# EAGLE design scheme (EAGLE 9.3.1)

## Sheet 1 of 6: Power Supply
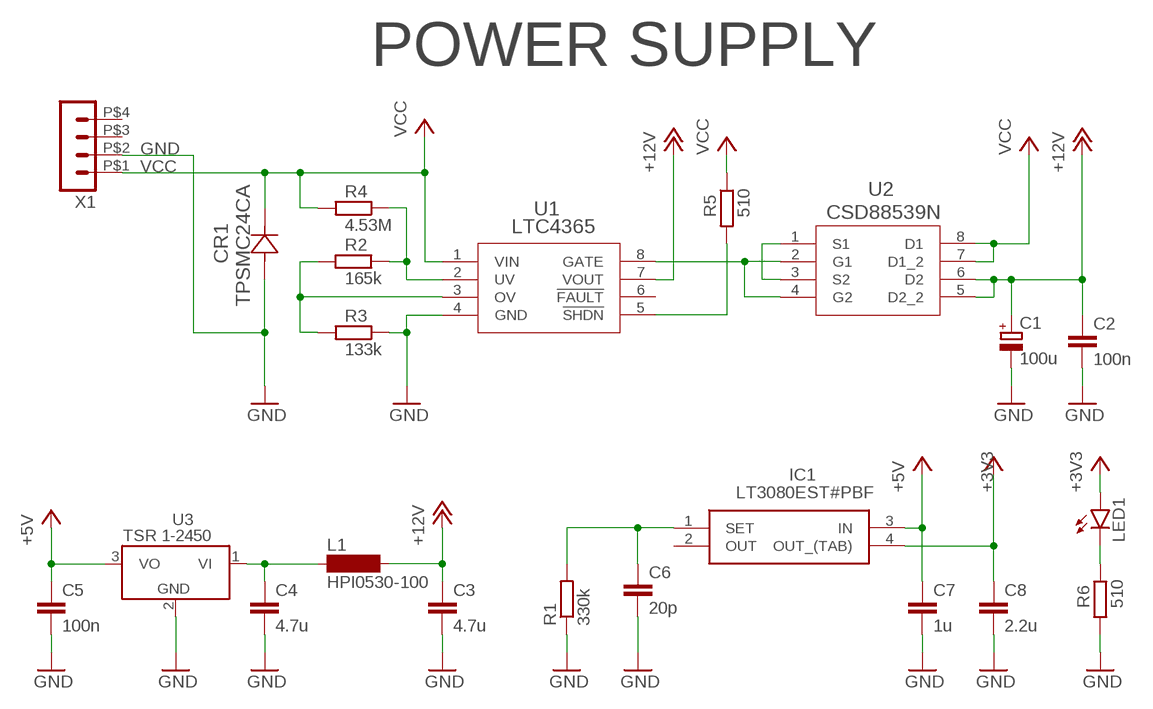
[diagram p0: schematic, sheet 1]

### Parts
C1  100u  CPOL-EUUD-6,3X7,7  [UD-6,3X7,7_NICHICON]
C2  100n  C-EUC0603K  [C0603K]
C3  4.7u  C-EUC0805  [C0805]
C4  4.7u  C-EUC0805  [C0805]
C5  100n  C-EUC0603K  [C0603K]
C6  20p  C-EUC0603K  [C0603K]
C7  1u  C-EUC0603  [C0603]
C8  2.2u  C-EUC0603  [C0603]
CR1  TPSMC24CA  TPSMC24CATPSMCSERIES-M  [TPSMCSERIES-M]
IC1  LT3080EST#PBF  [SOT230P700X180-4N]
L1  HPI0530-100  MS85  [MS85]
LED1  LEDCHIP-LED0805  [CHIP-LED0805]
R1  330k  R-EU_R0805  [R0805]
R2  165k  R-EU_R0603  [R0603]
R3  133k  R-EU_R0603  [R0603]
R4  4.53M  R-EU_R0603  [R0603]
R5  510  R-EU_R0603  [R0603]
R6  510  R-EU_R0603  [R0603]
U1  LTC4365  LTC4365CTS8TRMPBFTSOT-23_TS8-M  [TSOT-23_TS8-M]
U2  CSD88539N  CSD88539NDTD8-M  [D8-M]
U3  TSR 1-2450  TSR_1-2450  [TSR-1]
X1  HEADER_POS4_43045-0401  [43045-0400]

### Nets
+3V3: C8.1 IC1.4(OUT_(TAB)) LED1.A ; also sheet 2,3,4
+5V: C5.1 C7.1 IC1.3(IN) U3.3(VO) ; also sheet 3,4
+12V: C1.+ C2.1 C3.1 L1.2 U1.7(VOUT) U2.5(D2_2) U2.6(D2) ; also sheet 6
GND: C1.- C2.2 C3.2 C4.2 C5.2 C6.2 C7.2 C8.2 CR1.2 R1.1 R3.1 R6.2 U1.4(GND) U3.2(GND) X1.P$2 ; also sheet 2,3,4,5,6
LTC_G: U1.8(GATE) U2.2(G1) U2.4(G2)
N$1: R2.1 R3.2 U1.3(OV)
N$3: R5.2 U1.5(!SHDN)
N$4: R2.2 R4.1 U1.2(UV)
N$6: U2.1(S1) U2.3(S2)
N$7: C6.1 IC1.1(SET) R1.2
N$13: LED1.C R6.1
VCC: CR1.1 R4.2 R5.1 U1.1(VIN) U2.7(D1_2) U2.8(D1) X1.P$1
VI: C4.1 L1.1 U3.1(VI)
Unconnected: IC1.2(OUT) U1.6(!FAULT) X1.P$3 X1.P$4

### Notes on the sheet
- POWER SUPPLY

## Sheet 2 of 6: MCU
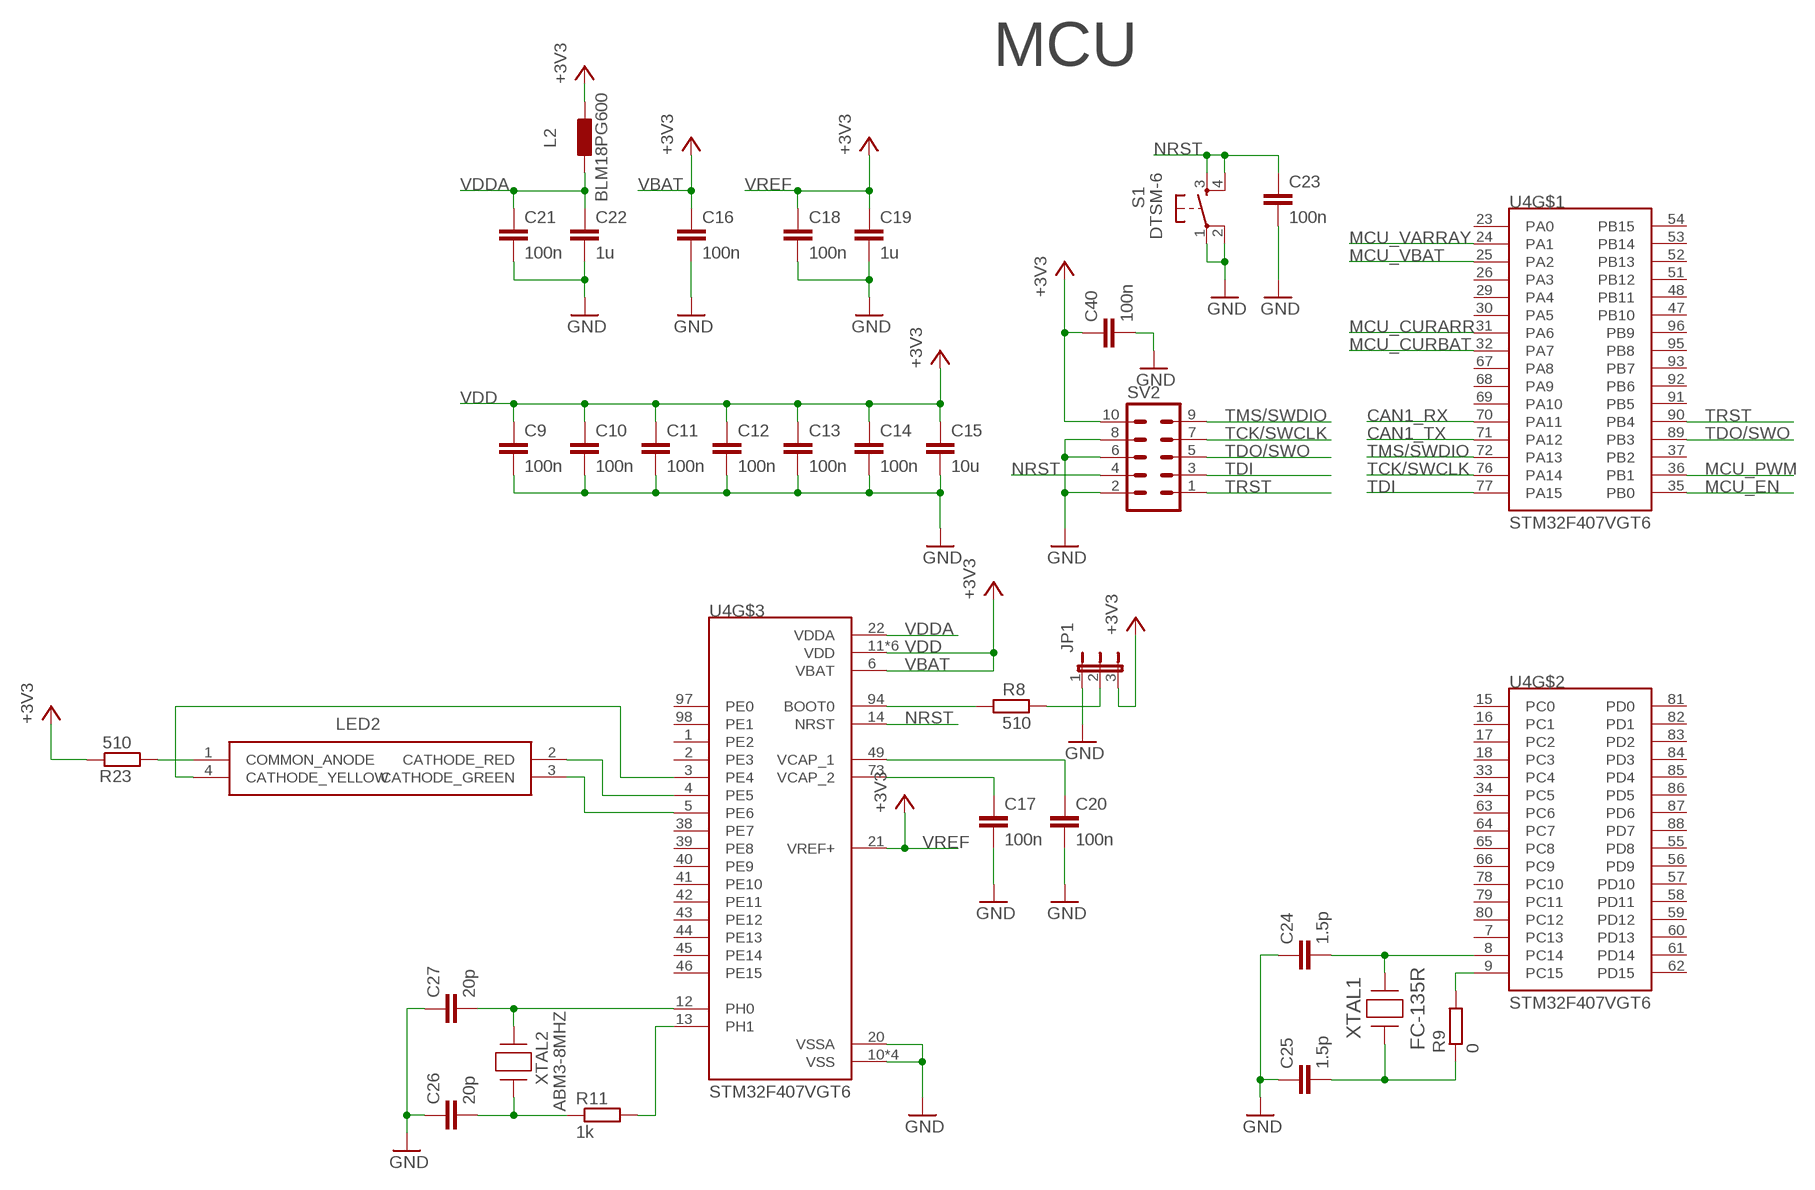
[diagram p1: schematic, sheet 2]

### Parts
C9  100n  C-EUC0603K  [C0603K]
C10  100n  C-EUC0603K  [C0603K]
C11  100n  C-EUC0603K  [C0603K]
C12  100n  C-EUC0603K  [C0603K]
C13  100n  C-EUC0603K  [C0603K]
C14  100n  C-EUC0603K  [C0603K]
C15  10u  C-EUC0603K  [C0603K]
C16  100n  C-EUC0603K  [C0603K]
C17  100n  C-EUC0603K  [C0603K]
C18  100n  C-EUC0603K  [C0603K]
C19  1u  C-EUC0603  [C0603]
C20  100n  C-EUC0603K  [C0603K]
C21  100n  C-EUC0603K  [C0603K]
C22  1u  C-EUC0603  [C0603]
C23  100n  C-EUC0603K  [C0603K]
C24  1.5p  C-EUC0603K  [C0603K]
C25  1.5p  C-EUC0603K  [C0603K]
C26  20p  C-EUC0603K  [C0603K]
C27  20p  C-EUC0603K  [C0603K]
C40  100n  C-EUC0805K  [C0805K]
JP1  JP2E  [JP2]
L2  BLM18PG600  L_EU_L0603  [L1608]
LED2  APTF1616SURKCGKSYKC  [KPTF1616RGBC11]
R8  510  R-EU_R0603  [R0603]
R9  0  R-EU_R0603  [R0603]
R11  1k  R-EU_R0603  [R0603]
R23  510  R-EU_R0603  [R0603]
S1  DTSM-6  [DTSM-6]
SV2  ML10  [ML10]
U4  STM32F407VGT6  [QFP50P1600X1600X160-100N]
XTAL1  FC-135R  FC-135R_32.7680KA-A3  [XTAL_KA-A3]
XTAL2  ABM3-8MHZ  ABM3-8.000MHZ-D2Y-T  [ABM38000MHZD2YT]

### Nets
+3V3: C9.1 C10.1 C11.1 C12.1 C13.1 C14.1 C15.1 C16.1 C18.1 C19.1 C40.1 JP1.3 L2.2 R23.1 SV2.10 U4.6(VBAT) U4.11(VDD) U4.19(VDD) U4.21(VREF+) U4.28(VDD) U4.50(VDD) U4.75(VDD) U4.100(VDD) ; also sheet 1,3,4
CAN1_RX: U4.70(PA11) ; also sheet 3
CAN1_TX: U4.71(PA12) ; also sheet 3
GND: C9.2 C10.2 C11.2 C12.2 C13.2 C14.2 C15.2 C16.2 C17.2 C18.2 C19.2 C20.2 C21.2 C22.2 C23.2 C24.1 C25.1 C26.1 C27.1 C40.2 JP1.1 S1.1 S1.2 SV2.2 SV2.6 SV2.8 U4.10(VSS) U4.20(VSSA) U4.27(VSS) U4.74(VSS) U4.99(VSS) ; also sheet 1,3,4,5,6
MCU_CURARR: U4.31(PA6) ; also sheet 5
MCU_CURBAT: U4.32(PA7) ; also sheet 5
MCU_EN: U4.35(PB0) ; also sheet 4
MCU_PWM: U4.36(PB1) ; also sheet 4
MCU_VARRAY: U4.24(PA1) ; also sheet 5
MCU_VBAT: U4.25(PA2) ; also sheet 5
N$2: C26.2 R11.1 XTAL2.1
N$5: C17.1 U4.73(VCAP_2)
N$8: C20.1 U4.49(VCAP_1)
N$9: R8.1 U4.94(BOOT0)
N$10: JP1.2 R8.2
N$11: C25.2 R9.1 XTAL1.1
N$12: R9.2 U4.9(PC15)
N$14: C24.2 U4.8(PC14) XTAL1.2
N$15: C27.2 U4.12(PH0) XTAL2.2
N$17: R11.2 U4.13(PH1)
N$24: LED2.1(COMMON_ANODE) R23.2
N$28: LED2.3(CATHODE_GREEN) U4.5(PE6)
N$29: LED2.2(CATHODE_RED) U4.4(PE5)
N$30: LED2.4(CATHODE_YELLOW) U4.3(PE4)
NRST: C23.1 S1.3 S1.4 SV2.4 U4.14(NRST)
TCK/SWCLK: SV2.7 U4.76(PA14)
TDI: SV2.3 U4.77(PA15)
TDO/SWO: SV2.5 U4.89(PB3)
TMS/SWDIO: SV2.9 U4.72(PA13)
TRST: SV2.1 U4.90(PB4)
VDDA: C21.1 C22.1 L2.1 U4.22(VDDA)
Unconnected: U4.1(PE2) U4.2(PE3) U4.7(PC13) U4.15(PC0) U4.16(PC1) U4.17(PC2) U4.18(PC3) U4.23(PA0) U4.26(PA3) U4.29(PA4) U4.30(PA5) U4.33(PC4) U4.34(PC5) U4.37(PB2) U4.38(PE7) U4.39(PE8) U4.40(PE9) U4.41(PE10) U4.42(PE11) U4.43(PE12) U4.44(PE13) U4.45(PE14) U4.46(PE15) U4.47(PB10) U4.48(PB11) U4.51(PB12) U4.52(PB13) U4.53(PB14) U4.54(PB15) U4.55(PD8) U4.56(PD9) U4.57(PD10) U4.58(PD11) U4.59(PD12) U4.60(PD13) U4.61(PD14) U4.62(PD15) U4.63(PC6) U4.64(PC7) U4.65(PC8) U4.66(PC9) U4.67(PA8) U4.68(PA9) U4.69(PA10) U4.78(PC10) U4.79(PC11) U4.80(PC12) U4.81(PD0) U4.82(PD1) U4.83(PD2) U4.84(PD3) U4.85(PD4) U4.86(PD5) U4.87(PD6) U4.88(PD7) U4.91(PB5) U4.92(PB6) U4.93(PB7) U4.95(PB8) U4.96(PB9) U4.97(PE0) U4.98(PE1)

### Notes on the sheet
- MCU
- VBAT | VREF
- VDD
- VDD
- VBAT
- VREF

## Sheet 3 of 6: CAN Bus
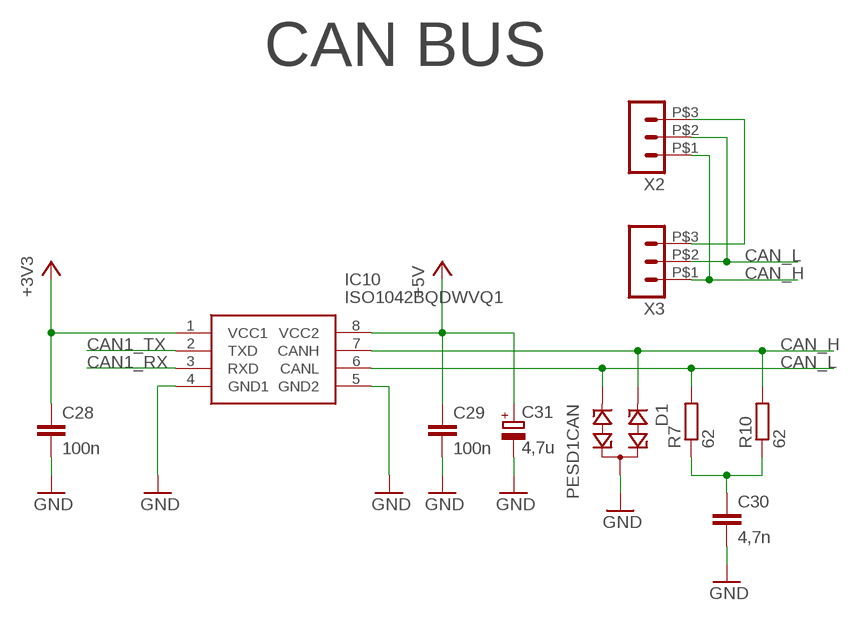
[diagram p2: schematic, sheet 3]

### Parts
C28  100n  C-EUC0603K  [C0603K]
C29  100n  C-EUC0603K  [C0603K]
C30  4,7n  C-EUC0603K  [C0603K]
C31  4,7u  CPOL-EUUD-4X5,8  [UD-4X5,8_NICHICON]
D1  PESD1CAN  [SOT23]
IC10  ISO1042BQDWVQ1  [SOIC127P1150X280-8N]
R7  62  R-EU_R0603  [R0603]
R10  62  R-EU_R0603  [R0603]
X2  HEADER_POS3_43650-0300  [43650-0300]
X3  HEADER_POS3_43650-0300  [43650-0300]

### Nets
+3V3: C28.1 IC10.1(VCC1) ; also sheet 1,2,4
+5V: C29.1 C31.+ IC10.8(VCC2) ; also sheet 1,4
CAN1_RX: IC10.3(RXD) ; also sheet 2
CAN1_TX: IC10.2(TXD) ; also sheet 2
CAN_H: D1.1 IC10.7(CANH) R10.2 X2.P$1 X3.P$1
CAN_L: D1.2 IC10.6(CANL) R7.2 X2.P$2 X3.P$2
GND: C28.2 C29.2 C30.2 C31.- D1.3 IC10.4(GND1) ; also sheet 1,2,4,5,6
N$16: C30.1 R7.1 R10.1
N$20: X2.P$3 X3.P$3
N$22: IC10.5(GND2) ; supply symbol labelled GND

### Notes on the sheet
- CAN BUS

## Sheet 4 of 6: GPIO Isolator
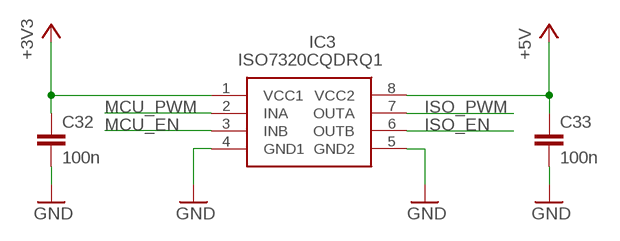
[diagram p3: schematic, sheet 4]

### Parts
C32  100n  C-EUC0603K  [C0603K]
C33  100n  C-EUC0603K  [C0603K]
IC3  ISO7320CQDRQ1  [SOIC127P600X175-8N]

### Nets
+3V3: C32.1 IC3.1(VCC1) ; also sheet 1,2,3
+5V: C33.1 IC3.8(VCC2) ; also sheet 1,3
GND: C32.2 C33.2 IC3.4(GND1) IC3.5(GND2) ; also sheet 1,2,3,5,6
ISO_EN: IC3.6(OUTB) ; also sheet 6
ISO_PWM: IC3.7(OUTA) ; also sheet 6
MCU_EN: IC3.3(INB) ; also sheet 2
MCU_PWM: IC3.2(INA) ; also sheet 2

## Sheet 5 of 6: MPPT Power Stage
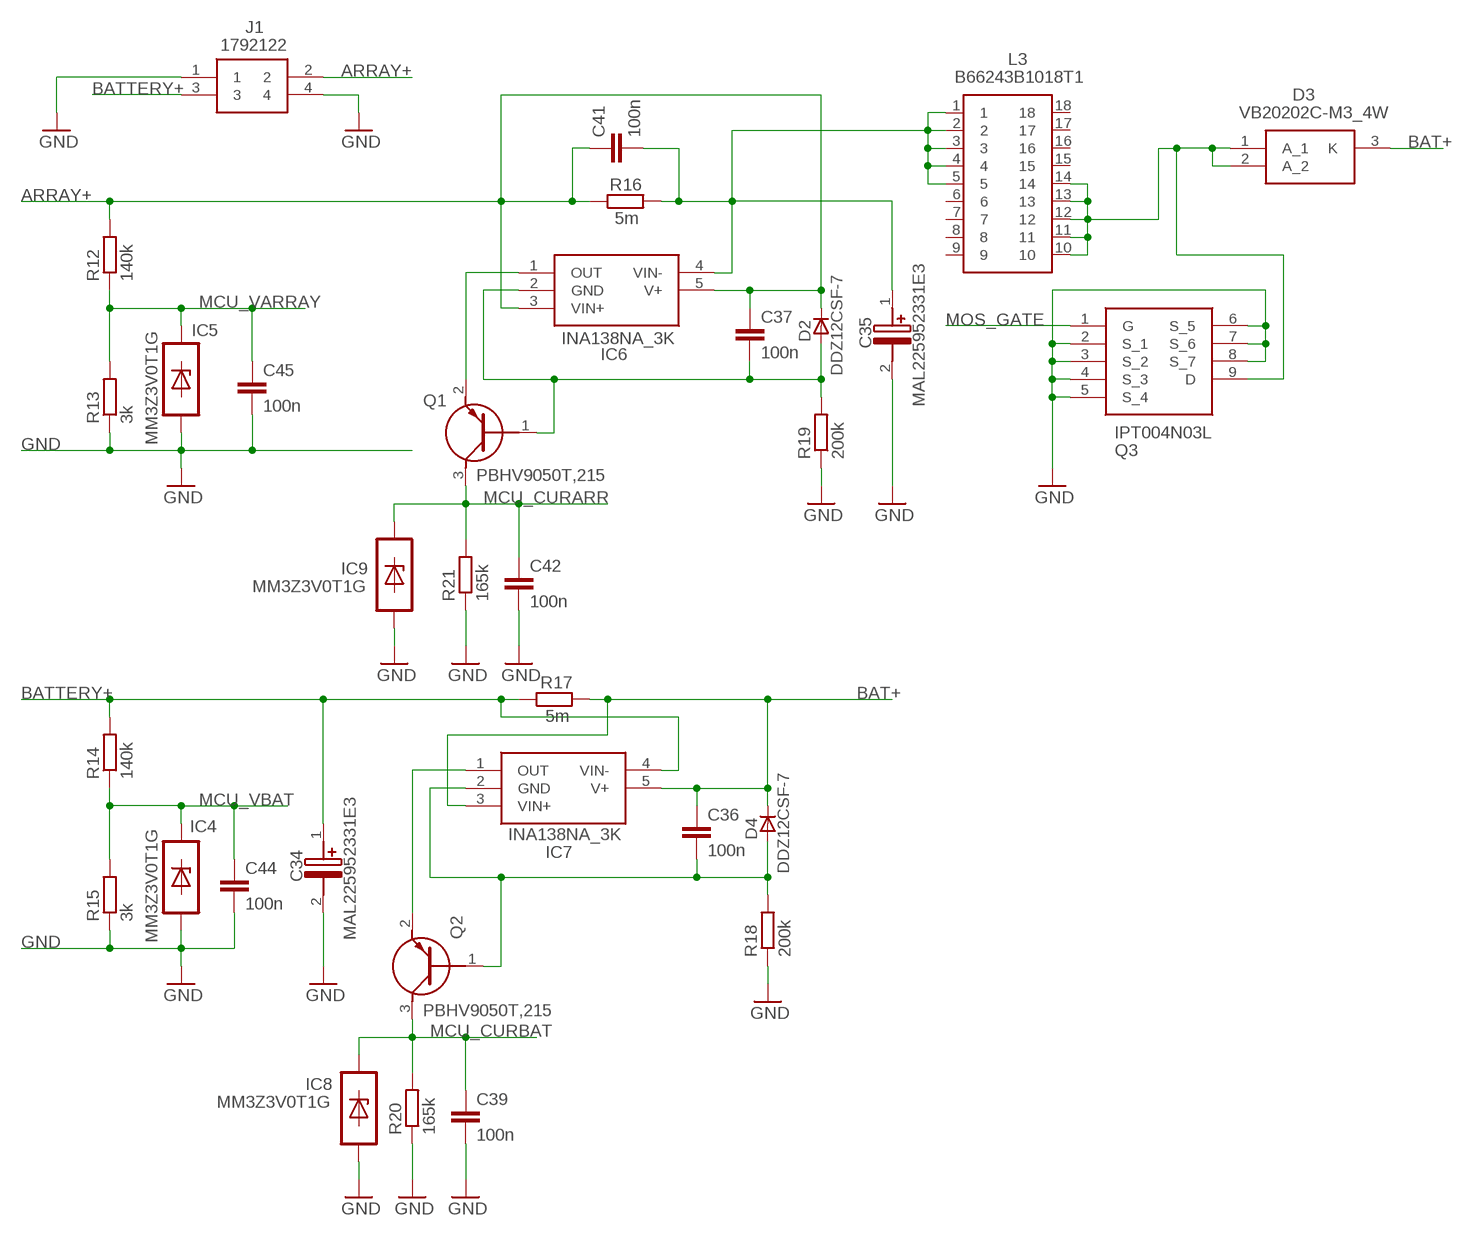
[diagram p4: schematic, sheet 5]

### Parts
C34  MAL225952331E3  [CAPPRD1000W200D2200H3000]
C35  MAL225952331E3  [CAPPRD1000W200D2200H3000]
C36  100n  C-EUC0603K  [C0603K]
C37  100n  C-EUC0603K  [C0603K]
C39  100n  C-EUC0603K  [C0603K]
C41  100n  C-EUC0603K  [C0603K]
C42  100n  C-EUC0603K  [C0603K]
C44  100n  C-EUC0805  [C0805]
C45  100n  C-EUC0805  [C0805]
D2  DDZ12CSF-7  1N4448WS  [SOD323F]
D3  VB20202C-M3_4W  [VB20202CM34W]
D4  DDZ12CSF-7  1N4448WS  [SOD323F]
IC4  MM3Z3V0T1G  SP4020-01FTG  [SOD323]
IC5  MM3Z3V0T1G  SP4020-01FTG  [SOD323]
IC6  INA138NA_3K  [SOT95P280X145-5N]
IC7  INA138NA_3K  [SOT95P280X145-5N]
IC8  MM3Z3V0T1G  SP4020-01FTG  [SOD323]
IC9  MM3Z3V0T1G  SP4020-01FTG  [SOD323]
J1  1792122  [1792122]
L3  B66243B1018T1  [DIPS2750W100P500L4600H4140Q18N]
Q1  PBHV9050T,215  [SOT95P230X110-3N]
Q2  PBHV9050T,215  [SOT95P230X110-3N]
Q3  IPT004N03L  [PG-HSOF-8-1]
R12  140k  R-EU_R0603  [R0603]
R13  3k  R-EU_R0603  [R0603]
R14  140k  R-EU_R0603  [R0603]
R15  3k  R-EU_R0603  [R0603]
R16  5m  R-EU_R2512  [R2512]
R17  5m  R-EU_R2512  [R2512]
R18  200k  R-EU_R0805  [R0805]
R19  200k  R-EU_R0805  [R0805]
R20  165k  R-EU_R0805  [R0805]
R21  165k  R-EU_R0805  [R0805]

### Nets
ARRAY+: C37.1 C41.1 D2.C IC6.3(VIN+) IC6.5(V+) J1.2 R12.2 R16.1
BAT+: C36.1 D3.3(K) D4.C IC7.3(VIN+) IC7.5(V+) R17.2
BATTERY+: C34.1(+) IC7.4(VIN-) J1.3 R14.2 R17.1
GND: C34.2(-) C35.2(-) C39.2 C42.2 C44.2 C45.2 IC4.2 IC5.2 IC8.2 IC9.2 J1.1 J1.4 Q3.2(S_1) Q3.3(S_2) Q3.4(S_3) Q3.5(S_4) Q3.6(S_5) Q3.7(S_6) Q3.8(S_7) R13.1 R15.1 R18.1 R19.1 R20.1 R21.1 ; also sheet 1,2,3,4,6
MCU_CURARR: C42.1 IC9.1 Q1.3(C) R21.2 ; also sheet 2
MCU_CURBAT: C39.1 IC8.1 Q2.3(C) R20.2 ; also sheet 2
MCU_VARRAY: C45.1 IC5.1 R12.1 R13.2 ; also sheet 2
MCU_VBAT: C44.1 IC4.1 R14.1 R15.2 ; also sheet 2
MOS_GATE: Q3.1(G) ; also sheet 6
N$18: C35.1(+) C41.2 IC6.4(VIN-) L3.1 L3.2 L3.3 L3.4 L3.5 R16.2
N$19: D3.1(A_1) D3.2(A_2) L3.10 L3.11 L3.12 L3.13 L3.14 Q3.9(D)
N$21: IC7.1(OUT) Q2.2(E)
N$23: IC6.1(OUT) Q1.2(E)
N$25: C36.2 D4.A IC7.2(GND) Q2.1(B) R18.2
N$26: C37.2 D2.A IC6.2(GND) Q1.1(B) R19.2
Unconnected: L3.6 L3.7 L3.8 L3.9 L3.15 L3.16 L3.17 L3.18

## Sheet 6 of 6: MOSFET DRIVER
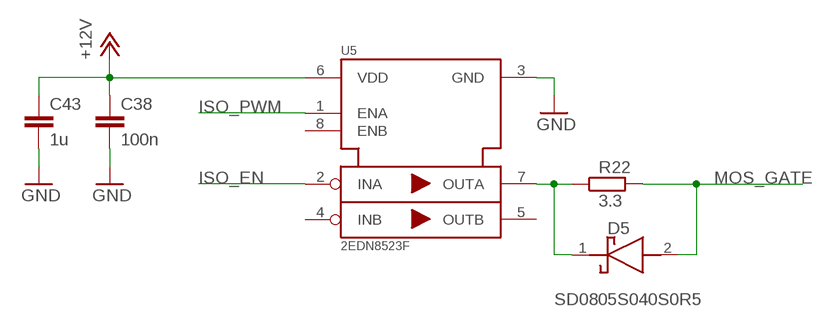
[diagram p5: schematic, sheet 6]

### Parts
C38  100n  C-EUC0603K  [C0603K]
C43  1u  C-EUC0603K  [C0603K]
D5  SD0805S040S0R5  [SD0805]
R22  3.3  R-EU_R0805  [R0805]
U5  2EDN8523F  [SOIC127P602X173-8N-V]

### Nets
+12V: C38.1 C43.1 U5.6(VDD) ; also sheet 1
GND: C38.2 C43.2 U5.3(GND) ; also sheet 1,2,3,4,5
ISO_EN: U5.2(INA) ; also sheet 4
ISO_PWM: U5.1(ENA) ; also sheet 4
MOS_GATE: D5.2(A) R22.2 ; also sheet 5
N$27: D5.1(K) R22.1 U5.7(OUTA)
Unconnected: U5.4(INB) U5.5(OUTB) U5.8(ENB)

## Library data of the parts
C1 C31 = rcl:CPOL-EU: POLARIZED CAPACITOR, European symbol; SPICEPREFIX: C
C2-C30 C32 C33 C36-C45 = rcl:C-EU: CAPACITOR, European symbol; SPICEPREFIX: C
C34 C35 = C_330uF_MAL225952331E3:MAL225952331E3: Aluminum Electrolytic Capacitors - Snap In 330uF 200V 20% 105C 3000H 22x30mm Source: Datasheet <http://www.mouser.com/datasheet/2/427/259phmsi-1289014.pdf>; DESCRIPTION: Aluminum Electrolytic Capacitors - Snap In 330uF 200V 20% 105C 3000H 22x30mm; HEIGHT: 30mm; MANUFACTURER_NAME: Vishay; MANUFACTURER_PART_NUMBER: MAL225952331E3
CR1 = TVS-TPSMC23CA:TPSMC24CA; BUILT_BY: EMA_UL_Team; MANUFACTURER_PART_NUMBER: TPSMC24CA; VENDOR: Littelfuse Inc
D1 = diode:PESD1CAN: CAN bus ESD protection diode Source: http://www.nxp.com/documents/data_sheet/PESD1CAN.pdf
D2 D4 = _hhn_diodes_smd:1N4448WS: 1N4448 General Purpose Rectifie SMD-Version of 1N4448 Case: SOD 323 F Author: Dipl.-Ing. FH Rainer Bayer HHN Hochschule Heilbronn, rainer.bayer@hs-heilbronn.de Ingenieurbüro ing-rb, mail@ing-rb.de
D3 = SamacSys_Parts:VB20202C-M3_4W: Schottky Diodes & Rectifiers 20A 200V Trench Stky Rectifier Source: Datasheet <https://www.vishay.com/docs/87797/v20202c.pdf>; ARROW_PART_NUMBER: VB20202C-M3/4W; DESCRIPTION: Schottky Diodes & Rectifiers 20A 200V Trench Stky Rectifier; HEIGHT: 4.83mm; MANUFACTURER_NAME: Vishay; MANUFACTURER_PART_NUMBER: VB20202C-M3/4W; MOUSER_PART_NUMBER: 78-VB20202C-M3/4W; MOUSER_PRICE-STOCK: https://www.mouser.com/Search/Refine.aspx?Keyword=78-VB20202C-M3%2F4W
D5 = SamacSys_Parts:SD0805S040S0R5: AVX - SD0805S040S0R5 - DIODE, SCHOTTKY, 0.5A, 40V, SOD-323 Source: Datasheet <http://catalogs.avx.com/SchottkyDiodes.pdf>; ARROW_PART_NUMBER: SD0805S040S0R5; ARROW_PRICE-STOCK: https://www.arrow.com/en/products/sd0805s040s0r5/avx; DESCRIPTION: AVX - SD0805S040S0R5 - DIODE, SCHOTTKY, 0.5A, 40V, SOD-323; HEIGHT: mm; MANUFACTURER_NAME: AVX; MANUFACTURER_PART_NUMBER: SD0805S040S0R5; MOUSER_PART_NUMBER: 581-SD0805S040S0R5; MOUSER_PRICE-STOCK: https://www.mouser.co.uk/ProductDetail/AVX/SD0805S040S0R5?qs=jCA%252BPfw4LHZwphObYhjVUA%3D%3D
IC1 = SamacSys_Parts:LT3080EST#PBF: Adjust single Resistor 1.1A LDO LT3080 LT3080EST#PBF, Low Dropout Voltage Regulator, Adjustable 1.1A, 0 30 V, 4-Pin SOT-223 Source: Datasheet <https://componentsearchengine.com/Datasheets/1/LT3080EST#PBF.pdf>; DESCRIPTION: Adjust single Resistor 1.1A LDO LT3080 LT3080EST#PBF, Low Dropout Voltage Regulator, Adjustable 1.1A, 0 30 V, 4-Pin SOT-223; HEIGHT: 1.8mm; MANUFACTURER_NAME: Linear Technology; MANUFACTURER_PART_NUMBER: LT3080EST#PBF; MOUSER_PART_NUMBER: 584-LT3080EST#PBF; MOUSER_PRICE-STOCK: https://www.mouser.com/Search/Refine.aspx?Keyword=584-LT3080EST%23PBF
IC3 = SamacSys_Parts:ISO7320CQDRQ1: TEXAS INSTRUMENTS - ISO7320CQDRQ1 - DIGITAL ISOLATOR, SOIC-8 Source: Datasheet <http://www.ti.com/general/docs/lit/getliterature.tsp?genericPartNumber=ISO7320-Q1&&fileType=pdf>; DESCRIPTION: TEXAS INSTRUMENTS - ISO7320CQDRQ1 - DIGITAL ISOLATOR, SOIC-8; HEIGHT: 1.75mm; MANUFACTURER_NAME: Texas Instruments; MANUFACTURER_PART_NUMBER: ISO7320CQDRQ1; MOUSER_PART_NUMBER: 595-ISO7320CQDRQ1; MOUSER_PRICE-STOCK: https://www.mouser.com/Search/Refine.aspx?Keyword=595-ISO7320CQDRQ1
IC4 IC5 IC8 IC9 = sp4020_10:SP4020-01FTG: SP4020 Series 2.5pF, 30A Discrete TVS Diode Source: http://www.littelfuse.com/~/media/electronics/datasheets/tvs_diode_arrays/littelfuse_tvs_diode_array_sp4020_datasheet.pdf.pdf; MF: Littelfuse; MPN: SP4020-01FTG; OC_FARNELL: unknown; OC_NEWARK: 05X0400
IC6 IC7 = SamacSys_Parts:INA138NA_3K: 36V, High-Side, Current Output Current Sense Amplifier Source: Datasheet <http://www.ti.com/lit/gpn/ina138>; DESCRIPTION: 36V, High-Side, Current Output Current Sense Amplifier; HEIGHT: 1.45mm; MANUFACTURER_NAME: Texas Instruments; MANUFACTURER_PART_NUMBER: INA138NA/3K; MOUSER_PART_NUMBER: 595-INA138NA/3K; MOUSER_PRICE-STOCK: https://www.mouser.co.uk/ProductDetail/Texas-Instruments/INA138NA-3K?qs=VBduBm9rCJR0Skb3Cd7oVw%3D%3D
IC10 = SamacSys_Parts:ISO1042BQDWVQ1: CAN Interface IC ISO1042BQDWV/RQ1 - M.2 TCAN1042 AUTOB Source: Datasheet <https://www.arrow.com/en/products/iso1042bqdwvq1/texas-instruments>; DESCRIPTION: CAN Interface IC ISO1042BQDWV/RQ1 - M.2 TCAN1042 AUTOB; HEIGHT: 2.8mm; MANUFACTURER_NAME: Texas Instruments; MANUFACTURER_PART_NUMBER: ISO1042BQDWVQ1; MOUSER_PART_NUMBER: 595-ISO1042BQDWVQ1; MOUSER_PRICE-STOCK: https://www.mouser.co.uk/ProductDetail/Texas-Instruments/ISO1042BQDWVQ1?qs=byeeYqUIh0PyMuwwywRJXg%3D%3D
J1 = SamacSys_Parts:1792122: Spring PCB terminal block 4 way 41A Source: Datasheet <http://uk.rs-online.com/web/p/products/7923385>; DESCRIPTION: Spring PCB terminal block 4 way 41A; HEIGHT: mm; MANUFACTURER_NAME: Phoenix Contact; MANUFACTURER_PART_NUMBER: 1792122; RS_PART_NUMBER: 7923385; RS_PRICE-STOCK: http://uk.rs-online.com/web/p/products/7923385
JP1 = jumper:JP2E: JUMPER
L1 = inductor-neosid:MS85: INDUCTOR SMD power inductor; OC_FARNELL: unknown; OC_NEWARK: unknown
L2 = PDFerr:L_EU_
L3 = B66243B1018T1:B66243B1018T1: Ferrite Cores & Accessories CF-E42/21 15-H-1S-18P/ Source: Datasheet; DESCRIPTION: Ferrite Cores & Accessories CF-E42/21 15-H-1S-18P/; HEIGHT: 41.4mm; MANUFACTURER_NAME: EPCOS; MANUFACTURER_PART_NUMBER: B66243B1018T1
LED1 = led:LED: LED OSRAM: - CHIPLED LG R971, LG N971, LY N971, LG Q971, LY Q971, LO R971, LY R971 LH N974, LH R974 LS Q976, LO Q976, LY Q976 LO Q996 - Hyper CHIPLED LW Q18S LB Q993, LB Q99A, LB R99A - SideLED LS A670, LO A670, LY A670, LG A670, LP A670 LB A673, LV A673, LT A673, LW A673 LH A674 LY A675 LS A676, LA A676, LO A676, LY A676, LW A676 LS A679, LY A679, LG A679 - Hyper Micro SIDELED® LS Y876, LA Y876, LO Y876, LY Y876 LT Y87S - SmartLED LW L88C, LW L88S LB L89C, LB L89S, LG L890 LS L89K, LO L89K, LY L89K LS L896, LA L896, LO L896, LY L896 - TOPLED LS T670, LO T670, LY T670, LG T670, LP T670 LSG T670, LSP T670, LSY T670, LOP T670, LYG T670 LG T671, LOG T671, LSG T671 LB T673, LV T673, LT T673, LW T673 LH T674 LS T676, LA T676, LO T676, LY T676, LB T676, LH T676, LSB T676, LW T676 LB T67C, LV T67C, LT T67C, LS T67K, LO T67K, LY T67K, LW E67C LS E67B, LA E67B, LO E67B, LY E67B, LB E67C, LV E67C, LT E67C LW T67C LS T679, LY T679, LG T679 LS T770, LO T770, LY T770, LG T770, LP T770 LB T773, LV T773, LT T773, LW T773 LH T774 LS E675, LA E675, LY E675, LS T675 LS T776, LA T776, LO T776, LY T776, LB T776 LHGB T686 LT T68C, LB T68C - Hyper Mini TOPLED® LB M676 - Mini TOPLED Santana® LG M470 LS M47K, LO M47K, LY M47K Source: http://www.osram.convergy.de LUXEON: - LUMILED® LXK2-PW12-R00, LXK2-PW12-S00, LXK2-PW14-U00, LXK2-PW14-V00 LXK2-PM12-R00, LXK2-PM12-S00, LXK2-PM14-U00 LXK2-PE12-Q00, LXK2-PE12-R00, LXK2-PE12-S00, LXK2-PE14-T00, LXK2-PE14-U00 LXK2-PB12-K00, LXK2-PB12-L00, LXK2-PB12-M00, LXK2-PB14-N00, LXK2-PB14-P00, LXK2-PB14-Q00 LXK2-PR12-L00, LXK2-PR12-M00, LXK2-PR14-Q00, LXK2-PR14-R00 LXK2-PD12-Q00, LXK2-PD12-R00, LXK2-PD12-S00 LXK2-PH12-R00, LXK2-PH12-S00 LXK2-PL12-P00, LXK2-PL12-Q00, LXK2-PL12-R00 Source: www.luxeon.com KINGBRIGHT: KA-3528ASYC Source: www.kingbright.com
LED2 = SamacSys_Parts:APTF1616SURKCGKSYKC: Standard LEDs - SMD RGY 1616 SMD Source: Datasheet; DESCRIPTION: Standard LEDs - SMD RGY 1616 SMD; HEIGHT: 0.9mm; MANUFACTURER_NAME: Kingbright; MANUFACTURER_PART_NUMBER: APTF1616SURKCGKSYKC; MOUSER_PART_NUMBER: 604-APTF1616KCGKSYKC; MOUSER_PRICE-STOCK: https://www.mouser.co.uk/ProductDetail/Kingbright/APTF1616SURKCGKSYKC?qs=FESYatJ8odK7UleJtP4p0g%3D%3D
Q1 Q2 = SamacSys_Parts:PBHV9050T,215: PBHV9050T - 500 V, 150 mA PNP high-voltage low VCEsat (BISS) transistor Source: Datasheet <http://assets.nexperia.com/documents/data-sheet/PBHV9050T.pdf>; DESCRIPTION: PBHV9050T - 500 V, 150 mA PNP high-voltage low VCEsat (BISS) transistor; HEIGHT: 1.1mm; MANUFACTURER_NAME: Nexperia; MANUFACTURER_PART_NUMBER: PBHV9050T,215
Q3 = SamacSys_Parts:IPT004N03L: MOSFET MV POWER MOS Source: Datasheet <https://www.infineon.com/dgdl/Infineon-IPT004N03L-DS-v02_00-EN.pdf?fileId=db3a30433e9d5d11013e9e0f382600c2>; DESCRIPTION: MOSFET MV POWER MOS; HEIGHT: mm; MANUFACTURER_NAME: Infineon; MANUFACTURER_PART_NUMBER: IPT004N03L; MOUSER_PART_NUMBER: 726-IPT004N03L; MOUSER_PRICE-STOCK: https://www.mouser.co.uk/ProductDetail/Infineon-Technologies/IPT004N03L?qs=jrjnRtnZuRuqKQmgUVbmUQ%3D%3D
R1-R23 = rcl:R-EU_: RESISTOR, European symbol; SPICEPREFIX: R
S1 = switch-tact:DTSM-6
SV2 = con-harting-ml:ML10: HARTING; OC_FARNELL: unknown; OC_NEWARK: unknown
U1 = LTC4365-Supply-Controller:LTC4365CTS8TRMPBF; BUILT_BY: EMA_UL_Team; MANUFACTURER_PART_NUMBER: LTC4365CTS8#TRMPBF; VENDOR: Linear Technology
U2 = MOS-N-2_Channel-CSD88539NDT :CSD88539NDT; BUILT_BY: EMA_UL_Team; MANUFACTURER_PART_NUMBER: CSD88539NDT; VENDOR: Texas Instruments
U3 = traco_tsr-1:TSR_1-*: TRACO TSR-1 Series Point-of-Load DC/DC-Converters Vi max. 36 V; Vo = (1.2 .. 15)V ±2%; Io = 0 .. 1 A SIP-Package (drop-in replacement for 78xx linear voltage regulators in TO220-package, vertically assembled) Source: www.tracopower.com Technologies: TSR 1- Vi (V) Vo (V) ±2% Io = 0 .. 1 A 24_ ( generic ) 2412 4.6 .. 36 1.2 2415 4.6 .. 36 1.5 2418 4.6 .. 36 1.8 2425 4.6 .. 36 2.5 2433 4.75.. 36 3.3 2450 6.5 .. 36 5.0 2465 9.0 .. 36 6.5 2490 12 .. 36 9.0 24120 15 .. 36 12 24150 18 .. 36 15 Author: Dipl.-Ing. FH Rainer Bayer HHN Hochschule Heilbronn, rainer.bayer@hs-heilbronn.de Ingenieurbüro ing-rb, mail@ing-rb.de
U4 = STM32F407VGT6:STM32F407VGT6: STM32 Series 32-bit 1 MB Flash 192 kB RAM ARM Based Microcontroller - LQFP-100; AVAILABILITY: Unavailable; DESCRIPTION: STM32 Series 32-bit 1 MB Flash 192 kB RAM ARM Based Microcontroller - LQFP-100; MF: STMicroelectronics; MP: STM32F407VGT6; PACKAGE: LQFP-100 STMicroelectronics; PRICE: None
U5 = 2EDN8523F:2EDN8523F: 2EDN8523F Advanced Dual Channel 5A Driver With Inverting Input logic, 8V UVLO SOIC127P602X173-8N-V
X1 = con-molex-micro-fit-3_0:HEADER_POS4_?: Molex - Micro-Fit 3.0 Series connector, 3.00mm (0.118") pitch header, 4 positions.
X2 X3 = con-molex-micro-fit-3_0:HEADER_POS3_?: Molex - Micro-Fit 3.0 Series connector, 3.00mm (0.118") pitch header, 3 positions.
XTAL1 = FC-135 32.7680:FC-135R_32.7680KA-A3; BUILT_BY: EMA_Matt; COPYRIGHT: Copyright (C) 2018 Accelerated Designs. All rights reserved; MANUFACTURER_PART_NUMBER: FC-135R 32.7680KA-A3; VENDOR: Epson
XTAL2 = SamacSys_Parts:ABM3-8.000MHZ-D2Y-T: Abracon 6 MHz, 8 MHz Crystal +/-20 ppm, +/-30 ppm 2-SMD, HC49/US, No Lead Source: Datasheet <https://componentsearchengine.com/Datasheets/1/ABM3-8.000MHZ-D2Y-T.pdf>; DESCRIPTION: Abracon 6 MHz, 8 MHz Crystal +/-20 ppm, +/-30 ppm 2-SMD, HC49/US, No Lead; HEIGHT: 1mm; MANUFACTURER_NAME: ABRACON; MANUFACTURER_PART_NUMBER: ABM3-8.000MHZ-D2Y-T; MOUSER_PART_NUMBER: 815-ABM3-8-D2Y-T; MOUSER_PRICE-STOCK: https://www.mouser.com/Search/Refine.aspx?Keyword=815-ABM3-8-D2Y-T

## Board
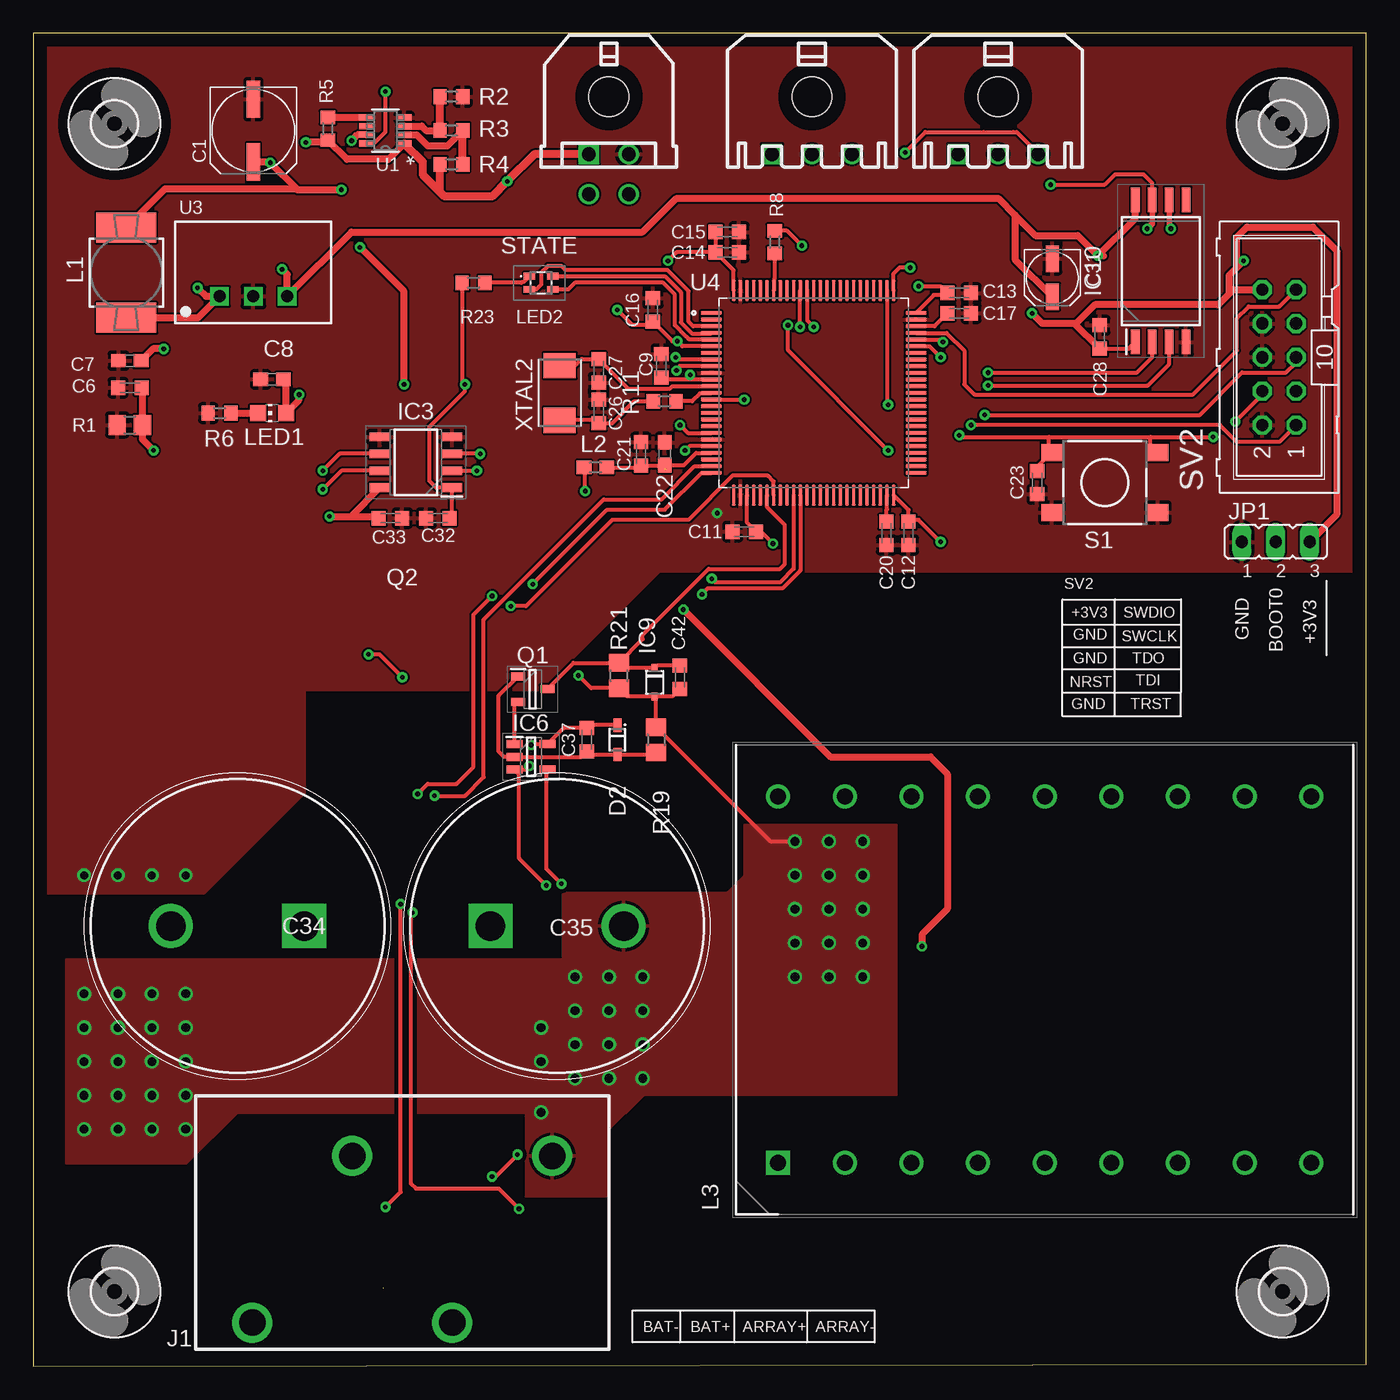
[diagram p6: board, top side]
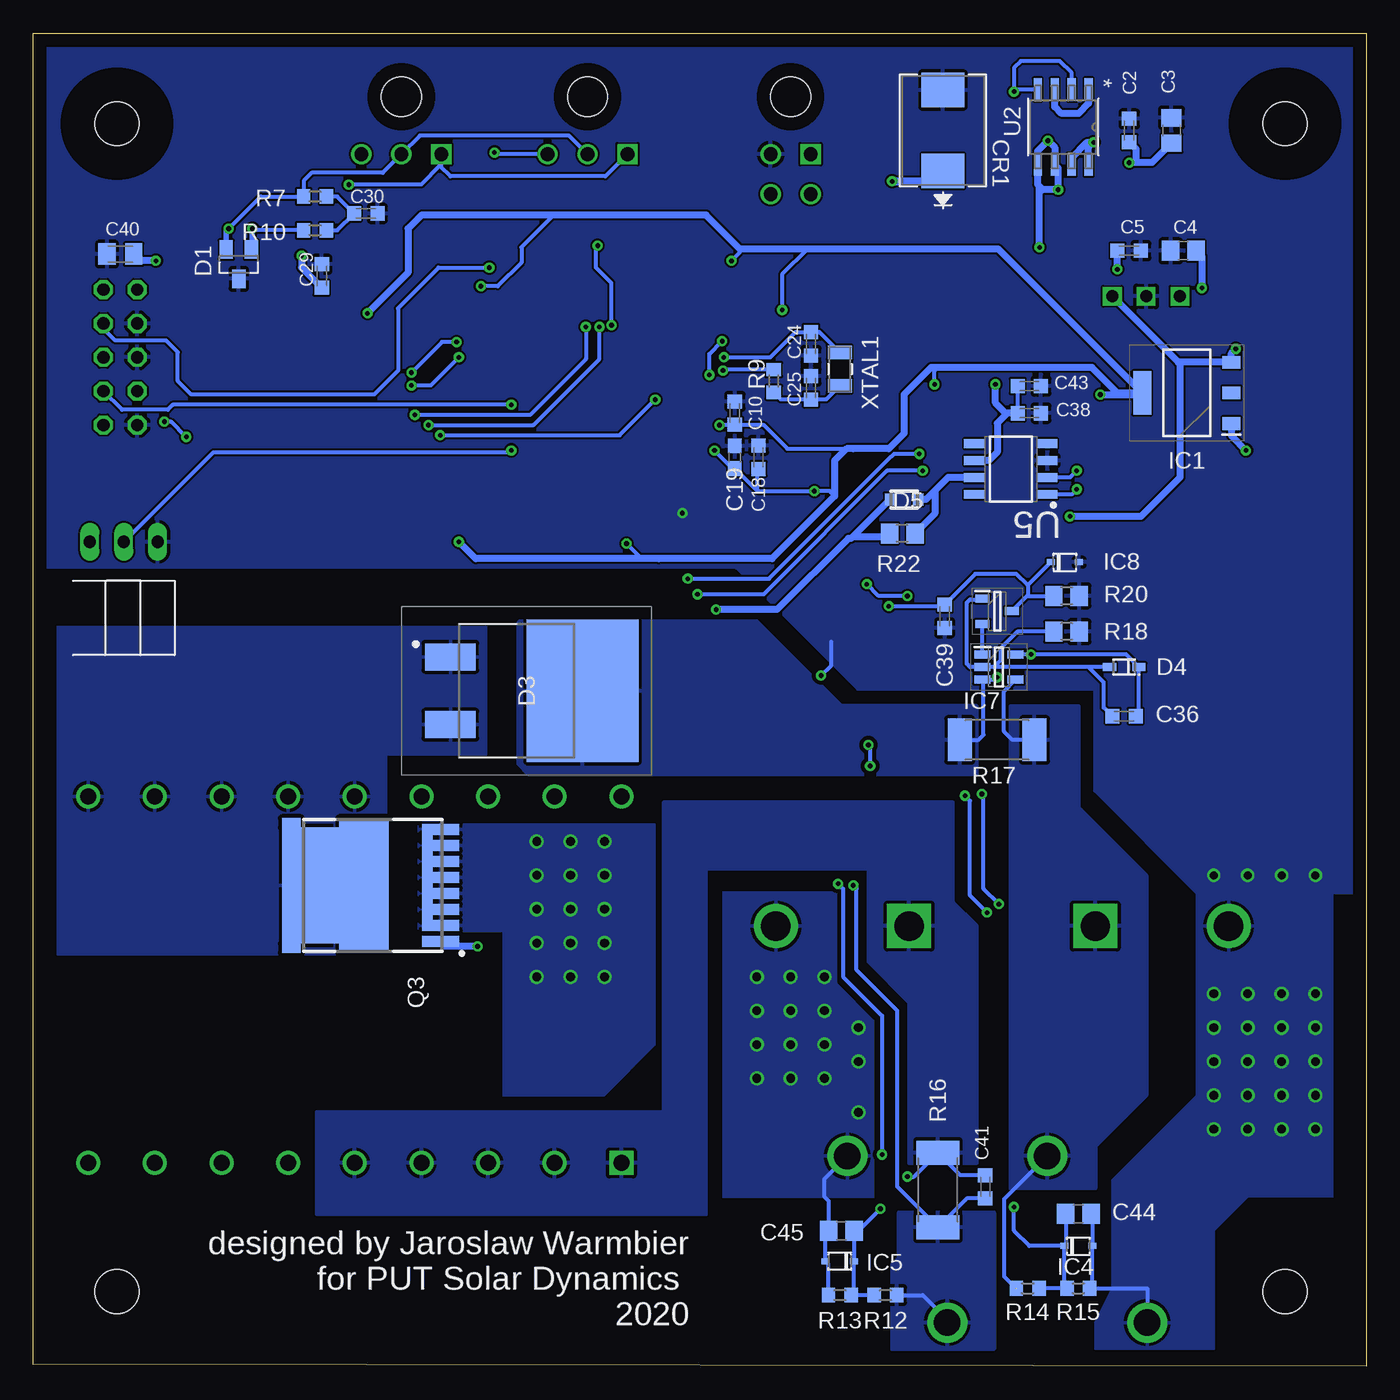
[diagram p7: board, bottom side, seen from below]

Size 100 x 100 mm. Coordinates in mm from the lower left corner, seen from the top.
Outline: 0,0 100,0.13 100,100 0,100 0,0
Copper layers (1*16): Top 0.035mm / dielectric 1.5mm / Bottom 0.035mm
Design rules "default": minimum track width 6mil, minimum drill 0.35mm, track to track 6mil, track to pad 6mil, pad to pad 6mil, via to via 6mil, smd to smd 6mil, copper to edge 40mil, drill to drill 6mil, minimum pad ring 10mil, minimum via ring 8mil, stop-mask expansion 4mil, vias tented up to drill 0mil, thermal gap 10mil

### Footprints (pad centres in the part's own frame; a part is rotated, then mirrored left to right if it is on the bottom)
UD-6,3X7,7_NICHICON = smd 2.8 x 1: + 2.35,0; - -2.35,0
C0603K = smd 1.05 x 1.08: 1 -0.875,0; 2 0.875,0
C0805 = smd 1.3 x 1.5: 1 -0.95,0; 2 0.95,0
C0603 = smd 1.1 x 1: 1 -0.85,0; 2 0.85,0
UD-4X5,8_NICHICON = smd 2 x 1: + 1.425,0; - -1.425,0
CAPPRD1000W200D2200H3000 = drill 2.2 pad 3.3 square: 1 0,0 | drill 2.2 pad 3.3: 2 10,0
C0805K = smd 1.3 x 1.6: 1 -1,0; 2 1,0
TPSMCSERIES-M = smd 2.565 x 3.2: 1 -3.035,0; 2 3.035,0
SOT23 = smd 1 x 1.4: 1 -0.95,-1.1; 2 0.95,-1.1; 3 0,1.1
SOD323F = smd 1 x 0.6: A 1.1,0; C -1.1,0
VB20202CM34W = smd 2.032 x 3.81: 1 -2.54,-4.958; 2 2.54,-4.958 | smd 10.66 x 8.38: 3 0,4.957
SD0805 = smd 0.8 x 0.9: 1 -1.05,0; 2 1.05,0
SOT230P700X180-4N = smd 1.35 x 0.95: 1 -3.35,2.3; 2 -3.35,0; 3 -3.35,-2.3 | smd 1.35 x 3.25: 4 3.35,0
SOIC127P600X175-8N = smd 1.528 x 0.65: 1 -2.711,1.905; 2 -2.711,0.635; 3 -2.711,-0.635; 4 -2.711,-1.905; 5 2.711,-1.905; 6 2.711,-0.635; 7 2.711,0.635; 8 2.711,1.905
SOD323 = smd 0.6 x 0.45: 1 -1.06,0; 2 1.06,0
SOT95P280X145-5N = smd 1.2 x 0.6: 1 -1.25,0.95; 2 -1.25,0; 3 -1.25,-0.95; 4 1.25,-0.95; 5 1.25,0.95
SOIC127P1150X280-8N = smd 1.85 x 0.65: 1 -5.325,1.905; 2 -5.325,0.635; 3 -5.325,-0.635; 4 -5.325,-1.905; 5 5.325,-1.905; 6 5.325,-0.635; 7 5.325,0.635; 8 5.325,1.905
1792122 = drill 2 pad 3: 1 4.25,-14.5; 2 11.75,-2; 3 19.25,-14.5; 4 26.75,-2
JP2 = drill 0.914 long: 1 -2.54,0; 2 0,0; 3 2.54,0
MS85 = smd 4.5 x 2.25: 1 0,-3.383; 2 0,3.383
L1608 = smd 1.1 x 1: 1 -0.85,0; 2 0.85,0
DIPS2750W100P500L4600H4140Q18N = drill 1.2 pad 1.8 square: 1 0,0 | drill 1.2 pad 1.8: 2 0,-5; 3 0,-10; 4 0,-15; 5 0,-20; 6 0,-25; 7 0,-30; 8 0,-35; 9 0,-40; 10 27.5,-40; 11 27.5,-35; 12 27.5,-30; 13 27.5,-25; 14 27.5,-20; 15 27.5,-15; 16 27.5,-10; 17 27.5,-5; 18 27.5,0
CHIP-LED0805 = smd 1.2 x 1.2: A 0,-1.05; C 0,1.05
KPTF1616RGBC11 = smd 0.85 x 0.5: 1 0.875,-0.5; 2 -0.875,-0.5; 3 -0.875,0.5; 4 0.875,0.5
SOT95P230X110-3N = smd 1.05 x 0.6: 1 -1.1,0.95; 2 -1.1,-0.95; 3 1.1,0
PG-HSOF-8-1 = smd 0.8 x 2.8: 1 0.75,0.098; 2 1.95,0.098; 3 3.15,0.098; 4 4.35,0.098; 5 5.55,0.098; 6 6.75,0.098; 7 7.95,0.098; 8 9.15,0.098 | smd 8.7 x 8: 9 4.95,7.998 | smd 0.5 x 0.8: 10 2.55,1.098; 11 3.75,1.098; 12 4.95,1.098; 13 6.15,1.098; 14 7.35,1.098; 15 8.55,1.098 | smd 0.7 x 3.7: 16 0.25,5.848; 17 9.65,5.848 | smd 0.7 x 1.4: 18 0.25,11.298; 19 9.65,11.298
R0805 = smd 1.3 x 1.5: 1 -0.95,0; 2 0.95,0
R0603 = smd 1 x 1.1: 1 -0.85,0; 2 0.85,0
R2512 = smd 1.8 x 3.2: 1 -2.8,0; 2 2.8,0
DTSM-6 = smd 1.55 x 1.3: 1 -3.975,2.25; 2 3.975,2.25; 3 -3.975,-2.25; 4 3.975,-2.25
ML10 = drill 0.914 octagon: 1 -5.08,-1.27; 2 -5.08,1.27; 3 -2.54,-1.27; 4 -2.54,1.27; 5 0,-1.27; 6 0,1.27; 7 2.54,-1.27; 8 2.54,1.27; 9 5.08,-1.27; 10 5.08,1.27
TSOT-23_TS8-M = smd 1.079 x 0.457: 1 -1.416,0.975; 2 -1.416,0.325; 3 -1.416,-0.325; 4 -1.416,-0.975; 5 1.416,-0.975; 6 1.416,-0.325; 7 1.416,0.325; 8 1.416,0.975
D8-M = smd 1.664 x 0.61: 1 -2.826,1.905; 2 -2.826,0.635; 3 -2.826,-0.635; 4 -2.826,-1.905; 5 2.826,-1.905; 6 2.826,-0.635; 7 2.826,0.635; 8 2.826,1.905
TSR-1 = drill 0.9 square: 1 -2.54,0; 2 0,0; 3 2.54,0
QFP50P1600X1600X160-100N = smd 1.56 x 0.28: 1 -7.68,6; 2 -7.68,5.5; 3 -7.68,5; 4 -7.68,4.5; 5 -7.68,4; 6 -7.68,3.5; 7 -7.68,3; 8 -7.68,2.5; 9 -7.68,2; 10 -7.68,1.5; 11 -7.68,1; 12 -7.68,0.5; 13 -7.68,0; 14 -7.68,-0.5; 15 -7.68,-1; 16 -7.68,-1.5; 17 -7.68,-2; 18 -7.68,-2.5; 19 -7.68,-3; 20 -7.68,-3.5; 21 -7.68,-4; 22 -7.68,-4.5; 23 -7.68,-5; 24 -7.68,-5.5; 25 -7.68,-6; 51 7.68,-6; 52 7.68,-5.5; 53 7.68,-5; 54 7.68,-4.5; 55 7.68,-4; 56 7.68,-3.5; 57 7.68,-3; 58 7.68,-2.5; 59 7.68,-2; 60 7.68,-1.5; 61 7.68,-1; 62 7.68,-0.5; 63 7.68,0; 64 7.68,0.5; 65 7.68,1; 66 7.68,1.5; 67 7.68,2; 68 7.68,2.5; 69 7.68,3; 70 7.68,3.5; 71 7.68,4; 72 7.68,4.5; 73 7.68,5; 74 7.68,5.5; 75 7.68,6 | smd 0.28 x 1.56: 26 -6,-7.68; 27 -5.5,-7.68; 28 -5,-7.68; 29 -4.5,-7.68; 30 -4,-7.68; 31 -3.5,-7.68; 32 -3,-7.68; 33 -2.5,-7.68; 34 -2,-7.68; 35 -1.5,-7.68; 36 -1,-7.68; 37 -0.5,-7.68; 38 0,-7.68; 39 0.5,-7.68; 40 1,-7.68; 41 1.5,-7.68; 42 2,-7.68; 43 2.5,-7.68; 44 3,-7.68; 45 3.5,-7.68; 46 4,-7.68; 47 4.5,-7.68; 48 5,-7.68; 49 5.5,-7.68; 50 6,-7.68; 76 6,7.68; 77 5.5,7.68; 78 5,7.68; 79 4.5,7.68; 80 4,7.68; 81 3.5,7.68; 82 3,7.68; 83 2.5,7.68; 84 2,7.68; 85 1.5,7.68; 86 1,7.68; 87 0.5,7.68; 88 0,7.68; 89 -0.5,7.68; 90 -1,7.68; 91 -1.5,7.68; 92 -2,7.68; 93 -2.5,7.68; 94 -3,7.68; 95 -3.5,7.68; 96 -4,7.68; 97 -4.5,7.68; 98 -5,7.68; 99 -5.5,7.68; 100 -6,7.68
SOIC127P602X173-8N-V = smd 1.47 x 0.65: 1 -2.765,1.905; 2 -2.765,0.635; 3 -2.765,-0.635; 4 -2.765,-1.905; 5 2.765,-1.905; 6 2.765,-0.635; 7 2.765,0.635; 8 2.765,1.905
3,3 = hole 3.3: 0,0
43045-0400 = drill 1.02 square: P$1 1.5,4.32 | drill 1.02: P$2 -1.5,4.32; P$3 1.5,7.32; P$4 -1.5,7.32 | hole 3: 0,0
43650-0300 = drill 1.02 square: P$1 3,4.32 | drill 1.02: P$2 0,4.32; P$3 -3,4.32 | hole 3: 0,0
XTAL_KA-A3 = smd 1.016 x 1.803: 1 -1.245,0; 2 1.245,0
ABM38000MHZD2YT = smd 1.9 x 2.4: 1 -2.05,0; 2 2.05,0

### Placement (x,y rotation side)
C1  16.51,92.71 270 top
C2  17.78,92.71 90 bottom
C3  14.61,92.71 90 bottom
C4  13.72,83.69 180 bottom
C5  17.78,83.69 0 bottom
C6  7.24,73.41 180 top
C7  7.24,75.44 180 top
C8  17.91,74.04 180 top
C9  47.12,75.06 90 top
C10  47.37,71.5 90 bottom
C11  53.34,62.61 180 top
C12  65.66,62.48 270 top
C13  69.47,80.52 0 top
C14  52.07,83.57 0 top
C15  52.07,85.09 0 top
C16  46.48,79.25 90 top
C17  69.47,78.99 0 top
C18  45.59,68.2 90 bottom
C19  47.37,68.2 90 bottom
C20  64.01,62.48 270 top
C21  45.59,68.45 90 top
C22  47.37,68.45 90 top
C23  75.31,66.29 270 top
C24  41.66,76.71 90 bottom
C25  41.66,73.41 270 bottom
C26  42.42,71.63 270 top
C27  42.42,74.68 90 top
C28  80.01,77.22 90 top
C29  78.36,81.79 90 bottom
C30  75.06,86.49 0 bottom
C31  76.45,81.66 270 top
C32  30.35,63.63 180 top
C33  26.8,63.63 0 top
C34  20.32,33.02 180 top
C35  34.29,33.02 0 top
C36  18.16,48.77 180 bottom
C37  41.53,46.99 270 top
C38  25.27,71.5 0 bottom
C39  31.62,56.26 270 bottom
C40  93.47,83.44 180 bottom
C41  28.57,13.46 90 bottom
C42  48.51,51.69 270 top
C43  25.27,73.53 0 bottom
C44  21.59,11.43 0 bottom
C45  39.37,10.16 180 bottom
CR1  31.75,92.71 90 bottom
D1  84.58,82.68 180 bottom
D2  43.81,46.99 270 top
D3  63.75,50.67 270 bottom
D4  18.16,52.45 180 bottom
D5  34.67,65.02 180 bottom
IC1  13.46,73.03 180 bottom
IC3  28.7,67.82 180 top
IC4  21.59,9.02 0 bottom
IC5  39.5,7.87 180 bottom
IC6  37.34,45.72 0 top
IC7  27.56,52.45 0 bottom
IC8  22.61,60.33 0 bottom
IC9  46.61,51.31 270 top
IC10  84.58,82.17 90 top
J1  43.18,1.27 180 top
JP1  93.22,61.85 0 top
L1  6.99,82.04 0 top
L2  42.16,67.44 180 top
L3  55.88,15.24 90 top
LED1  17.91,71.5 90 top
LED2  38.1,81.28 180 top
Q1  37.47,50.8 0 top
Q2  27.69,56.64 0 bottom
Q3  69.34,31.11 90 bottom
R1  7.24,70.61 0 top
R2  31.37,92.71 0 top
R3  31.37,95.25 180 top
R4  31.37,90.17 180 top
R5  22.1,92.84 90 top
R6  13.97,71.5 180 top
R7  78.87,87.76 180 bottom
R8  55.63,84.33 90 top
R9  44.45,73.91 90 bottom
R10  78.87,85.22 180 bottom
R11  47.37,72.39 0 top
R12  36.07,5.33 0 bottom
R13  39.5,5.33 0 bottom
R14  25.4,5.84 180 bottom
R15  21.59,5.84 180 bottom
R16  32.13,13.21 90 bottom
R17  27.69,46.99 180 bottom
R18  22.48,55.12 180 bottom
R19  46.74,46.99 270 top
R20  22.48,57.78 180 bottom
R21  43.94,51.82 90 top
R22  34.8,62.48 180 bottom
R23  33.02,81.28 0 top
S1  80.39,66.29 180 top
SV2  93.47,75.69 90 top
U1  26.42,92.71 180 top
U2  22.73,92.96 270 bottom
U3  16.51,80.26 0 top
U4  58.55,73.03 0 top
U5  26.67,67.31 180 bottom
U$1  [3,3]  93.73,93.22 0 top
U$2  [3,3]  6.1,93.22 0 top
U$3  [3,3]  6.1,5.59 0 top
U$4  [3,3]  93.73,5.59 0 top
X1  43.18,95.25 180 top
X2  58.42,95.25 180 top
X3  72.39,95.25 180 top
XTAL1  39.5,74.8 90 bottom
XTAL2  39.5,73.03 90 top

### Tracks (layer width: path | path; a pad name or v marks a point on that pad's centre or on a via)
+3V3  (via drill 0.35)  (1 unrouted)
  Top 0.305: U4.21 49.21,69.03 v48.9,68.71 | 46.48,78.36 C16.1 | C14.1 52.55,82.21 U4.100 | C15.1 C14.1 | v48.51,70.61 49.1,70.03 U4.19 | C12.1 65.66,63.5 | 65.66,63.5 65.66,64.23 U4.50 | U4.75 67.56,80.36 67.56,80.39 68.47,80.39 C13.1 68.09,81.03 v66.42,81.03 | U4.28 53.55,63.28 C11.1 54.61,62.61 v55.5,61.72 | U4.11 49.53,74.03 | 49.53,74.03 47.27,74.03 C9.1 | 49.53,74.03 49.28,74.28 v49.28,74.37 | v43.81,79.25 44.94,78.12 46.23,78.12 C16.1 | C14.1 48.26,83.57 v47.62,82.93 | v68.07,61.85 66.42,63.5 65.66,63.5 | v41.4,65.66 41.4,67.35 L2.2 | C32.1 31.41,63.81 IC3.1 30.23,65.91 29.72,66.42 29.72,70.48 32.38,73.15 v32.38,73.66 32.17,73.88 R23.1 | C28.1 82.17,76.34 IC10.1 | C16.1 47.95,76.91 v48.32,76.91 48.7,76.53 U4.6
  Top 0.508: C8.1 18.96,73.84 LED1.A 19.94,72.48 v19.94,72.9 | 89.72,80.45 90.04,80.77 SV2.10 | 89.72,80.45 88.9,79.63 79.63,79.63 78.23,78.23 78.12,78.23 | v74.93,78.99 75.69,78.23 78.12,78.23 | 78.12,78.23 C28.1 80.07,76.28 | 89.72,80.45 89.72,81.85 90.3,82.42 | 90.3,82.42 v90.81,82.93 | 90.3,82.42 90.3,84.71 91.06,85.47 96.01,85.47 97.79,83.69 97.79,63.88 JP1.3
  Bottom 0.305: v48.9,68.71 47.51,67.32 | v48.51,70.61 48.5,70.63 C10.1 45.23,70.63 43.43,68.83 38.48,68.83 | v49.28,74.37 49.28,75.95 v48.32,76.91 | 41.91,83.82 43.81,81.92 v43.81,79.25 | v47.62,82.93 46.99,83.57 46.99,83.82 | 60.96,86.36 63.37,83.95 63.37,82.8 65.15,81.03 v66.42,81.03 | v55.5,61.72 54.36,60.58 53.09,60.58 | 39.88,65.28 40.26,65.66 v41.4,65.66 45.68,65.66 | C19.1 45.68,65.66 | v32.38,73.66 32.38,74.68 32.64,74.93 | 45.68,65.66 45.68,67.24 C18.1
  Bottom 0.508: v19.94,72.9 16.94,72.9 IC1.4 | v90.81,82.93 91.96,82.93 C40.1 | IC1.4 27.61,83.82 41.91,83.82 46.99,83.82 49.53,86.36 60.96,86.36 70.87,86.36 71.88,85.34 71.88,82.04 v74.93,78.99 | IC1.4 18.67,73.03 20.57,74.93 32.64,74.93 34.67,72.9 34.67,69.98 35.81,68.83 38.48,68.83 38.99,68.83 39.88,67.94 39.88,65.28 44.58,60.58 53.09,60.58 66.8,60.58 v68.07,61.85
+5V  (via drill 0.35)
  Top 0.508: v18.67,82.3 19.05,81.92 U3.3 23.88,85.09 45.72,85.09 48.26,87.63 72.39,87.63 73.66,86.36 | v9.78,76.33 8.98,76.33 C7.1 | C31.+ 73.66,83.03 73.66,86.36 | 80.31,83.31 v79.88,83.31 | 73.66,86.36 75.18,84.84 78.36,84.84 v79.88,83.31 | C33.1 25.8,63.75 v22.23,63.75 23.83,63.75 IC3.8 | v79.88,83.31 82.68,86.11 IC10.8
  Bottom 0.508: v18.67,82.3 18.66,82.31 C5.1 | v9.78,76.33 10.11,75.99 IC1.3 14.11,75.33 | v79.88,83.31 79.88,82.44 C29.1 | U3.3 14.11,75.33 | 14.11,75.33 13.97,75.18 13.97,66.67 16.89,63.75 v22.23,63.75
+12V  (via drill 0.35)
  Top 0.508: v23.88,91.95 24.05,92.13 24.31,92.39 U1.7 | C1.+ 17.72,90.36 v17.78,90.3 19.75,88.33 | 19.75,88.33 19.81,88.27 v23.11,88.27 | L1.2 9.89,88.33 19.75,88.33 | v27.81,73.66 27.81,80.64 v24.51,83.95
  Bottom 0.305: C38.1 C43.1
  Bottom 0.508: C3.1 16.07,90.3 17.27,90.3 | 17.27,90.3 v17.78,90.3 | C2.1 17.27,91.33 17.27,90.3 | 24.51,88.52 24.26,88.27 v23.11,88.27 23.11,89.88 U2.6 23.37,91.44 v23.88,91.95 24.64,91.19 U2.5 24.64,88.65 24.51,88.52 | C38.1 26.92,71.5 26.99,71.44 | U5.6 28.32,67.94 27.69,68.58 27.69,70.74 26.99,71.44 | 26.99,71.44 27.81,72.26 v27.81,73.66 | v24.51,83.95 24.51,88.52
ARRAY+  (via drill 0.35)
  Top 0.305: D2.C 41.75,48.09 C37.1 39.78,47.87 IC6.5 37.4,46.67 v37.34,46.61 | v38.48,36.07 36.45,38.1 36.45,44.41 IC6.3 36.94,44.77 v37.21,45.04
  Bottom 0.305: R12.2 33.27,5.33 31.43,3.49 J1.2 | R16.1 | R16.1 35.18,13.46 35.18,26.67 38.23,29.72 38.23,35.81 v38.48,36.07 | C41.1 29.96,12.59 R16.1 | v37.21,45.04 37.21,46.48 v37.34,46.61
  pour Bottom: 27.94,1.27 35.56,1.27 35.56,7.62 35.05,8.13 35.05,11.56 27.94,11.56
BAT+  (via drill 0.35)
  Top 0.305: v27.69,51.69 25.97,53.4 v25.15,53.4
  Bottom 0.305: 26.24,53.47 IC7.5 v25.15,53.4 18.01,53.4 D4.C 17.06,48.99 C36.1 | R17.2 29.08,46.99 28.7,47.37 28.7,51.39 IC7.3 27.87,51.5 v27.69,51.69
  pour Bottom (isolate 0.305): 29.21,45.72 29.21,49.53 39.37,49.53 45.72,55.88 63.5,55.88 63.63,55.75 63.63,45.21 62.87,44.45 60.96,44.45 29.21,44.45
BATTERY+  (1 unrouted)
  Bottom 0.305: J1.3 27.18,12.52 27.18,6.73 26.29,5.84 | R17.1 26.54,46.99 27.18,47.62 27.18,50.63 IC7.4
  pour Bottom: 20.32,13.34 26.67,13.34 26.67,49.53 21.59,49.53 21.59,41.91 16.51,36.83 16.51,20.32 20.32,16.51
CAN1_RX  (via drill 0.35)
  Top 0.305: U4.70 67.24,76.53 v68.07,75.69 | v71.63,73.58 83.61,73.58 85.22,75.18 IC10.3
  Bottom 0.305: v68.07,75.69 70.18,73.58 v71.63,73.58
CAN1_TX  (via drill 0.35)
  Top 0.305: U4.71 68.06,77.03 v68.24,76.84 | v71.63,74.55 82.8,74.55 82.87,74.61 83.19,74.93 83.95,75.69 IC10.2
  Bottom 0.305: v68.24,76.84 69.33,76.84 v71.63,74.55
CAN_H  (via drill 0.35)
  Top 0.305: v76.33,88.65 80.39,88.65 81.15,89.41 83.31,89.41 83.95,88.77 IC10.7
  Top 0.406: IC10.7 83.95,85.72 v83.57,85.34
  Bottom 0.305: X2.P$1 57.07,89.28 68.71,89.28 69.39,89.96 69.39,90.17 | 69.39,90.17 X3.P$1 | 69.39,90.17 70.91,88.65 v76.33,88.65 | 80.01,84.92 R10.2 83.44,85.22 v83.57,85.34
  Bottom 0.406: v83.57,85.34 83.57,83.84 D1.1
CAN_L  (via drill 0.35)
  Top 0.406: v85.34,85.34 85.22,85.47 IC10.6
  Bottom 0.305: X2.P$2 59.82,92.33 70.99,92.33 X3.P$2 73.78,89.53 79.12,89.53 79.72,88.94 R7.2 82.93,87.76 v85.34,85.34
  Bottom 0.406: D1.2 85.53,85.16 v85.34,85.34
GND  (via drill 0.35, 0.6, 0.65)
  Top 0.305: IC9.2 44.56,50.25 R21.1 41.84,50.87 v40.89,51.82 | C42.2 47.95,50.25 IC9.2 | IC9.2 46.74,50.12 R19.1 55.31,39.37 v57.15,39.37
  Bottom 0.305: J1.4 16.43,5.84 R15.1 20.53,6.05 IC4.2 20.53,11.32 C44.2 | 40.56,5.54 R13.1 40.35,7.66 IC5.2 40.56,9.92 C45.2 40.32,12.38 40.64,12.7 40.64,14.06 J1.1 | v40.89,51.82 40.13,52.58 40.13,54.36
  other vias: 40.64,29.21 11.43,22.86 8.89,22.86 8.89,20.32 11.43,20.32 8.89,17.78 11.43,17.78 6.35,17.78 3.81,17.78 3.81,20.32 6.35,20.32 6.35,22.86 3.81,22.86 3.81,25.4 3.81,27.94 6.35,25.4 6.35,27.94 8.89,25.4 8.89,27.94 11.43,25.4 11.43,27.94 38.1,19.05 40.64,21.59 43.18,21.59 45.72,21.59 45.72,24.13 43.18,24.13 40.64,24.13 38.1,22.86 38.1,25.4 40.64,26.67 43.18,26.67 45.72,26.67 45.72,29.21 43.18,29.21 57.15,29.21 59.69,29.21 62.23,29.21 62.23,31.75 59.69,31.75 57.15,31.75 57.15,34.29 59.69,34.29 62.23,34.29 62.23,36.83 59.69,36.83 57.15,36.83 59.69,39.37 62.23,39.37 3.81,36.83 6.35,36.83 8.89,36.83 11.43,36.83 51.31,64.01
  pour Bottom (isolate 0.305): 36.96,12.7 36.96,25.91 39.75,28.7 39.75,35.56 48.26,35.56 48.26,12.7
  pour Bottom (isolate 0.305): 53.34,40.64 71.12,40.64 71.12,32.64 64.77,32.64 64.77,20.32 57.15,20.32 53.34,24.13
  pour Top (isolate 0.305): 39.75,35.56 52.07,35.56 53.34,36.83 53.34,40.64 64.77,40.64 64.77,20.32 45.72,20.32 43.18,17.78 43.18,12.7 36.96,12.7 36.96,25.65 39.75,28.45
  pour Bottom (isolate 0.305): 11.43,1.27 20.32,1.27 20.32,3.3 19.05,5.84 19.05,13.97 12.7,20.32 12.7,38.1 2.54,38.1 2.54,12.7 8.89,12.7 11.43,10.16
  pour Top (isolate 0.305): 2.54,30.48 55.88,30.48 44.45,19.05 15.24,19.05 11.43,15.24 2.54,15.24
  pour Bottom (isolate 0.152): -2.54,35.56 12.7,35.56 20.32,43.18 20.32,50.8 38.1,50.8 47.24,59.94 101.6,59.94 101.6,101.6 -2.54,101.6
  pour Top (isolate 0.152): -2.54,101.6 -2.54,35.56 12.83,35.56 20.32,43.05 20.32,50.8 38.1,50.8 46.99,59.69 102.87,59.69 102.87,101.6
ISO_EN  (via drill 0.35)
  Top 0.305: IC3.6 22.99,68.45 v21.72,67.18
  Bottom 0.305: v21.72,67.18 22.23,66.67 U5.2
ISO_PWM  (via drill 0.35)
  Top 0.305: IC3.7 23.11,67.18 v21.72,65.79
  Bottom 0.305: v21.72,65.79 22.1,65.41 U5.1
LTC_G  (via drill 0.35)
  Top 0.305: U1.8 25.09,91.83 25.64,91.83 26.42,92.6 v26.42,95.63
  Bottom 0.305: v26.42,95.63 26.26,95.79 | 26.26,95.79 U2.4 | U2.2 22.1,97.03 22.99,97.92 25.91,97.92 26.42,97.41 26.42,95.95 26.26,95.79
MCU_CURARR
  Top 0.305: U4.31 55.05,64.46 56.39,63.12 56.39,60.2 56.01,59.82 50.67,59.82 45.72,54.86 45.72,54.54 R21.2 43.18,52.77 | Q1.3 40.53,52.77 43.18,52.77 | 43.18,52.77 43.58,52.37 IC9.1 46.8,52.56 C42.1
MCU_CURBAT  (via drill 0.35)
  Top 0.305: U4.32 55.55,66.37 55.12,66.8 52.45,66.8 49.15,63.5 43.43,63.5 36.96,57.02 v35.81,57.02
  Bottom 0.305: Q2.3 25.44,57.78 25.4,57.78 | 25.4,57.78 R20.2 | IC8.1 25.4,58.59 | 25.4,58.59 25.4,57.78 | v35.81,57.02 31.74,57.02 C39.1 29.32,59.44 26.25,59.44 25.4,58.59
MCU_EN  (via drill 0.35)
  Top 0.305: U4.35 57.05,59.84 56.01,58.8 51.18,58.8 v50.9,59.08 | v33.53,68.45 IC3.3
  Bottom 0.305: v50.9,59.08 44.81,59.08 35.61,68.28 35.58,68.28 35.41,68.45 v33.53,68.45
MCU_PWM  (via drill 0.35)
  Top 0.305: v50.16,57.91 50.6,58.34 56.2,58.34 57.55,59.69 U4.36 | IC3.2 v33.27,67.18
  Bottom 0.305: v33.27,67.18 35.94,67.18 45.21,57.91 v50.16,57.91
MCU_VARRAY  (via drill 0.35)
  Top 0.305: v30.1,42.8 32.38,42.8 33.78,44.2 33.78,56.01 42.8,65.02 47.12,65.02 49.62,67.53 U4.24 | v28.45,34.04 28.32,33.91 28.32,13.72 28.7,13.34 34.92,13.34 v36.45,11.81
  Bottom 0.305: R12.1 R13.2 38.44,5.54 IC5.1 38.42,7.89 C45.1 | v28.45,34.04 29.72,35.31 29.72,42.42 v30.1,42.8 | 38.17,9.91 C45.1 | v36.45,11.81 38.1,10.16 C45.1
MCU_VBAT  (via drill 0.35)
  Top 0.305: v26.42,11.94 27.56,13.08 v27.56,34.67 | v28.83,42.93 29.59,43.69 31.75,43.69 33.02,44.96 33.02,56.39 v34.42,57.78 | v37.47,58.67 43.05,64.26 47.37,64.26 50.13,67.03 U4.25
  Bottom 0.305: R14.1 R15.2 22.65,6.05 IC4.1 | IC4.1 25.27,9.02 26.42,10.16 v26.42,11.94 | v27.56,34.67 28.7,35.81 28.7,42.8 v28.83,42.93 | v34.42,57.78 36.58,57.78 v37.47,58.67 | C44.1 22.54,9.13 IC4.1
MOS_GATE  (via drill 0.35)
  Top 0.508: v48.77,56.77 59.82,45.72 67.31,45.72 68.58,44.45 68.58,34.29 66.67,32.38 v66.67,31.5
  Bottom 0.508: D5.2 38.52,62.23 | 38.52,62.23 38.64,62.1 38.86,62.1 44.2,56.77 v48.77,56.77 | 38.52,62.23 35.56,62.23 35.75,62.42 R22.2 | v66.67,31.5 69.07,31.5 Q3.1
N$1
  Top 0.508: U1.3 29.14,93.03 29.46,92.71 R2.1
  Top 0.61: R2.1 R3.2
N$2
  Top 0.305: R11.1 45.09,72.39 43.45,70.75 C26.2 42.2,70.97 XTAL2.1
N$3
  Top 0.508: U1.5 R5.2
N$4
  Top 0.508: U1.2 28.77,92.39 29.59,91.57 31.08,91.57 R2.2
  Top 0.61: R4.1 R2.2
N$5
  Top 0.305: C17.1 67.62,78.03 U4.73
N$6
  Bottom 0.508: U2.1 20.83,94.74 21.59,93.98 22.86,93.98 23.37,94.49 U2.3
N$7  (via drill 0.35)
  Top 0.508: v9.02,68.71 8.19,69.53 R1.2 8.19,73.33 C6.1
  Bottom 0.508: IC1.1 10.11,69.8 v9.02,68.71
N$8
  Top 0.305: C20.1 64.01,64.26 64.05,64.3 U4.49
N$9
  Top 0.305: U4.94 55.6,80.76 55.6,81.57 55.63,81.59 R8.1
N$10  (via drill 0.35)
  Top 0.305: v64.14,68.71 56.62,76.22 v56.62,78.11 | v57.66,84.07 56.55,85.18 R8.2
  Bottom 0.305: JP1.2 86.49,68.58 64.26,68.58 v64.14,68.71 | v56.62,78.11 56.62,81.26 57.78,82.42 57.78,83.95 v57.66,84.07
N$11
  Bottom 0.305: XTAL1.1 40.52,72.53 C25.2 43.92,72.53 R9.1
N$12  (via drill 0.35)
  Top 0.305: v48.26,74.71 48.26,74.8 48.51,75.06 50.84,75.06 U4.9
  Bottom 0.305: R9.2 48.2,74.76 v48.26,74.71
N$13
  Top 0.508: R6.1 LED1.C
N$14  (via drill 0.35)
  Top 0.305: U4.8 48.36,75.53 v48.19,75.7
  Bottom 0.305: v48.19,75.7 44.7,75.7 42.81,77.58 C24.2 41.03,77.58 XTAL1.2
N$15
  Top 0.305: XTAL2.2 40.66,75.08 41.15,75.56 41.16,75.55 C27.2 44.62,73.35 47.78,73.35 47.96,73.53 U4.12
N$16
  Bottom 0.305: R7.1 77.2,87.76 C30.1 77.2,85.22 R10.1
N$17
  Top 0.305: U4.13 50.81,72.97 50,72.97 49.42,72.39 R11.2
N$18  (via drill 0.35)
  Top 0.305: IC6.4 38.48,44.66 38.48,37.34 v39.62,36.2 | v36.32,15.88 34.67,14.22 v34.42,14.22
  Bottom 0.305: v39.62,36.2 39.24,35.81 39.24,29.21 36.32,26.29 v36.32,15.88 | v34.42,14.22 33.91,14.22 R16.2 30.46,14.34 C41.2
  pour Bottom (isolate 0.305): 34.29,15.24 29.21,15.24 29.21,33.02 30.99,34.8 30.99,42.29 52.7,42.29 52.7,19.05 78.74,19.05 78.74,11.43 49.53,11.43 49.53,37.34 37.34,37.34 37.34,30.35 34.29,27.3
N$19
  pour Bottom (isolate 0.305): 66.04,55.5 66.04,45.85 73.53,45.85 73.53,30.86 98.17,30.86 98.17,55.5
N$20  (via drill 0.35)
  Top 0.305: v65.41,91.06 66.93,92.58 71.28,92.58 73.5,92.58 73.79,92.58 75.39,90.98 X3.P$3
  Bottom 0.305: X2.P$3 65.28,90.93 v65.41,91.06
N$21
  Bottom 0.305: IC7.1 28.79,53.42 Q2.2
N$23
  Top 0.305: IC6.1 36.09,49.57 Q1.2
N$24
  Top 0.305: LED2.1 36.78,81.33 36.67,81.33 36.62,81.28 R23.2
N$25
  Bottom 0.305: D4.A 20.83,52.45 | 20.83,52.45 27.94,52.45 | 27.94,52.45 IC7.2 29.72,52.45 29.97,52.7 29.97,57.28 29.72,57.53 28.85,57.53 Q2.1 | R18.2 26.16,55.12 27.43,53.85 27.43,52.96 27.94,52.45 | C36.2 19.68,49.42 19.68,51.31 20.83,52.45
N$26
  Top 0.305: Q1.1 34.92,50.31 34.92,46.1 35.31,45.72 IC6.2 41.13,45.72 C37.2 41.75,45.89 D2.A 46.59,45.89 R19.2
N$27
  Bottom 0.508: U5.7 31.37,66.67 32.32,65.72 | D5.1 33.02,65.02 32.32,65.72 | R22.1 32.32,64.01 32.32,65.72
N$28
  Top 0.305: U4.5 49.21,77.03 49.15,77.09 49.02,77.22 48.13,78.11 48.13,80.39 47.24,81.28 40.64,81.28 40.13,80.77 LED2.3
N$29
  Top 0.305: LED2.2 47.39,81.78 48.59,80.58 48.59,78.3 49.4,77.48 50.82,77.48 U4.4
N$30
  Top 0.305: U4.3 49.51,78.03 49.16,78.37 49.16,80.66 47.58,82.24 39.94,82.24 39.62,82.55 38.61,82.55 38.1,82.04 38.1,81.15 37.73,80.78 LED2.4
NRST  (via drill 0.35)
  Top 0.305: C23.1 75.31,67.44 S1.4 76.2,68.76 76.2,69.72 | v53.33,72.53 v53.34,72.52 50.88,72.52 U4.14 | v90.17,70.87 92.2,72.9 SV2.4 | v69.47,69.85 69.6,69.72 76.2,69.72 | 76.2,69.72 83.82,69.72 | 83.82,69.72 v88.52,69.72 | S1.3 83.82,69.09 83.82,69.72
  Bottom 0.305: v69.47,69.85 56.01,69.85 v53.34,72.52 | v88.52,69.72 89.66,70.87 v90.17,70.87
TCK/SWCLK  (via drill 0.35)
  Top 0.305: U4.76 64.55,81.97 65,82.42 v65.79,82.42
  Bottom 0.305: v65.79,82.42 69.6,82.42 72.64,79.38 72.64,74.68 74.42,72.9 88.14,72.9 89.15,73.91 89.15,76.07 90.04,76.96 93.85,76.96 94.74,77.85 SV2.7
TDI  (via drill 0.35)
  Top 0.305: U4.77 64.05,72.22 v64.14,72.14
  Bottom 0.305: v64.14,72.14 89.53,72.14 89.92,71.75 93.34,71.75 SV2.3
TDO/SWO  (via drill 0.35)
  Top 0.305: U4.89 58.05,78.48 v58.55,77.98 | v71.37,71.37 87.5,71.37 90.68,74.55 93.98,74.55 94.74,75.31 SV2.5
  Bottom 0.305: v58.55,77.98 58.55,75.56 62.74,71.37 v71.37,71.37
TMS/SWDIO
  Top 0.305: SV2.9 93.47,79.5 91.19,79.5 90.3,78.61 90.3,76.2 87,72.9 70.61,72.9 69.85,73.66 69.85,76.2 68.53,77.53 U4.72
TRST  (via drill 0.35)
  Top 0.305: SV2.1 93.47,69.34 90.3,69.34 89.03,70.61 v70.36,70.61 | v57.53,77.98 57.53,80.69 U4.90
  Bottom 0.305: v70.36,70.61 62.48,70.61 57.53,75.56 v57.53,77.98
VCC  (via drill 0.35)
  Top 0.508: U1.1 26.65,90.55 23.53,90.55 R5.1 21.93,91.82 v20.45,91.82
  Top 0.61: X1.P$1 37.59,90.93 v35.56,88.9 34.42,87.76 30.86,87.76 30.52,88.1 | 30.52,88.1 R4.2 | U1.1 29.21,90.36 29.21,89.41 30.52,88.1
  Bottom 0.508: U2.8 20.83,91.44 v20.45,91.82 20.95,91.82 22.1,90.68 U2.7
  Bottom 0.61: v35.56,88.9 32.52,88.9 CR1.1
VDDA
  Top 0.305: U4.22 49.73,68.53 48.81,67.6 C22.1 47.35,67.58 C21.1 45.45,67.44 L2.1
VI  (via drill 0.35)
  Top 0.508: L1.1 12.37,78.66 U3.1 12.95,80.26 v12.32,80.9
  Bottom 0.508: C4.1 12.32,83.25 v12.32,80.9

### Text on the board
tNames: STATE | SV2 | GND | BOOT0 | +3V3 | +3V3 | SWDIO | GND | SWCLK | GND | TDO | NRST | TDI | GND | TRST | BAT- | BAT+ | ARRAY+ | ARRAY-
bNames: designed by Jaroslaw Warmbier / for PUT Solar Dynamics / 2020